# EAGLE design cdciom8 (EAGLE 6.6.0)
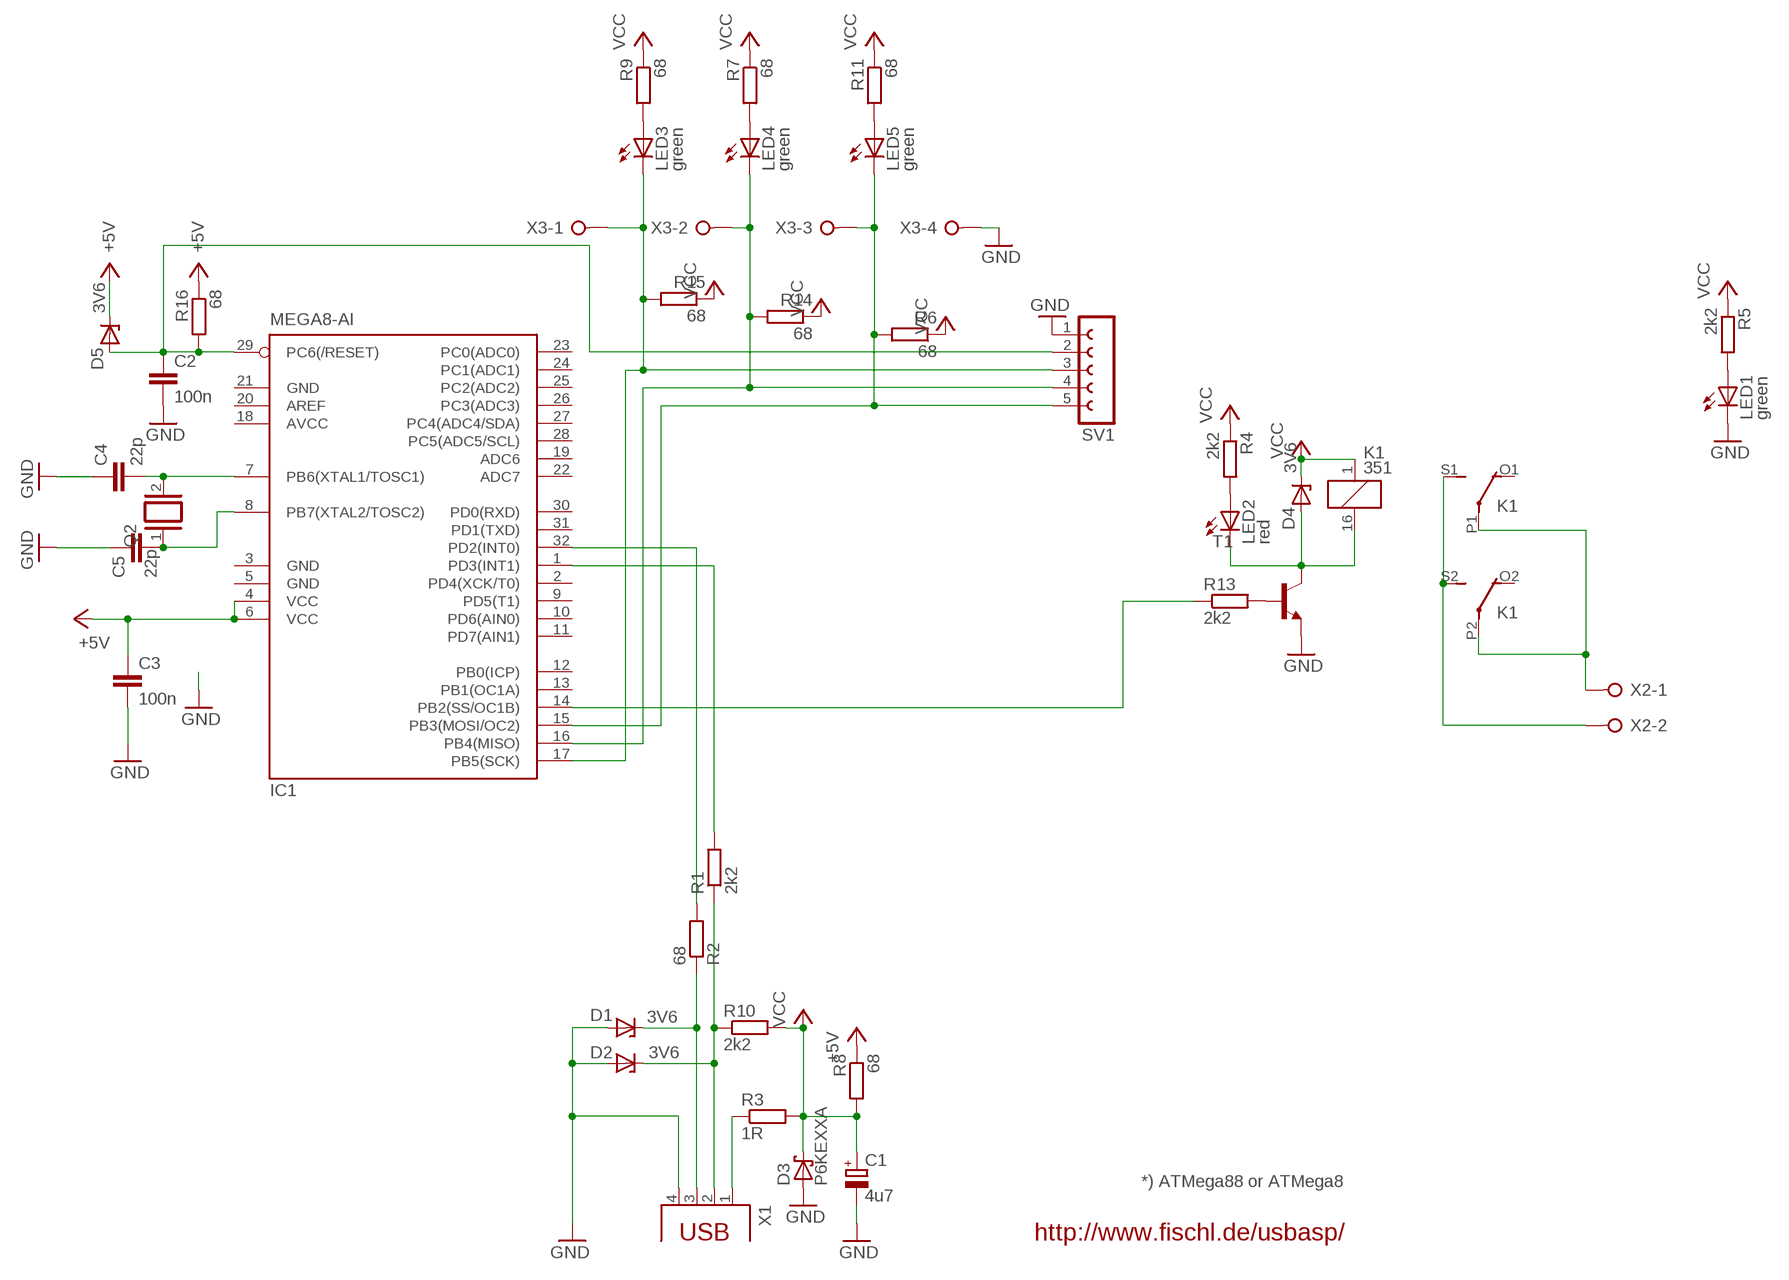
[diagram p0: schematic, sheet 1]

## Parts
C1  4u7  CPOL-EUE2.5-5  [E2,5-5]
C2  100n  C-EU025-024X044  [C025-024X044]
C3  100n  C-EU025-024X044  [C025-024X044]
C4  22p  C-EU025-024X044  [C025-024X044]
C5  22p  C-EU025-024X044  [C025-024X044]
D1  3V6  ZENER-DIODEDO34-7  [DO34Z7]
D2  3V6  ZENER-DIODEDO34-7  [DO34Z7]
D3  P6KEXXA  [C1702-15]
D4  3V6  ZENER-DIODEDO34-7  [DO34Z7]
D5  3V6  ZENER-DIODEDO34-7  [DO34Z7]
IC1  MEGA8-AI  [TQFP32-08]
K1  351  [351]
LED1  green  LED3MM  [LED3MM]
LED2  red  LED3MM  [LED3MM]
LED3  green  LED3MM  [LED3MM]
LED4  green  LED3MM  [LED3MM]
LED5  green  LED3MM  [LED3MM]
Q2  XTAL/S  [QS]
R1  2k2  R-EU_0207/2V  [0207/2V]
R2  68  R-EU_0207/10  [0207/10]
R3  1R  R-EU_0207/2V  [0207/2V]
R4  2k2  R-EU_0207/2V  [0207/2V]
R5  2k2  R-EU_0207/2V  [0207/2V]
R6  68  R-EU_0207/10  [0207/10]
R7  68  R-EU_0207/10  [0207/10]
R8  68  R-EU_0207/10  [0207/10]
R9  68  R-EU_0207/10  [0207/10]
R10  2k2  R-EU_0207/2V  [0207/2V]
R11  68  R-EU_0207/10  [0207/10]
R13  2k2  R-EU_0207/2V  [0207/2V]
R14  68  R-EU_0207/10  [0207/10]
R15  68  R-EU_0207/10  [0207/10]
R16  68  R-EU_0207/10  [0207/10]
SV1  FE05-1  [FE05-1]
T1  2N4124-NPN-TO92-CBE  [TO92-CBE]
X1  PN61729  [PN61729]
X2  W237-02P  [W237-132]
X3  W237-04P  [W237-4P]

## Nets
+5V: C3.1 D5.C IC1.4(VCC) IC1.6(VCC) R8.1 R16.1
GND: C1.- C2.2 C3.2 C4.1 C5.1 D1.A D2.A D3.A LED1.K(C) SV1.1 T1.E X1.4 X3.4
N$1: C2.1 D5.A IC1.29(PC6(/RESET)) R16.2 SV1.2
N$2: R13.2 T1.B
N$3: IC1.14(PB2(SS/OC1B)) R13.1
N$4: D4.A K1.16 LED2.K(C) T1.C
N$5: D2.C R1.1 R10.1 X1.2
N$6: K1.S1(2:S) K1.S2(3:S) X2.2
N$7: IC1.32(PD2(INT0)) R2.2
N$8: D1.C R2.1 X1.3
N$9: LED2.A R4.2
N$10: K1.P1(2:P) K1.P2(3:P) X2.1
N$11: R3.1 X1.1
N$12: LED1.A R5.2
N$13: LED3.A R9.2
N$14: LED4.A R7.2
N$15: LED5.A R11.2
N$16: IC1.1(PD3(INT1)) R1.2
N$17: IC1.17(PB5(SCK)) LED3.K(C) R15.2 SV1.3 X3.1
N$18: IC1.16(PB4(MISO)) LED4.K(C) R14.2 SV1.4 X3.2
N$19: IC1.15(PB3(MOSI/OC2)) LED5.K(C) R6.2 SV1.5 X3.3
N$22: C4.2 IC1.7(PB6(XTAL1/TOSC1)) Q2.2
N$23: C5.2 IC1.8(PB7(XTAL2/TOSC2)) Q2.1
VCC: C1.+ D3.C D4.C K1.1 R3.2 R4.1 R5.1 R6.1 R7.1 R8.2 R9.1 R10.2 R11.1 R14.1 R15.1
Unconnected: IC1.2(PD4(XCK/T0)) IC1.9(PD5(T1)) IC1.10(PD6(AIN0)) IC1.11(PD7(AIN1)) IC1.12(PB0(ICP)) IC1.13(PB1(OC1A)) IC1.19(ADC6) IC1.20(AREF) IC1.22(ADC7) IC1.23(PC0(ADC0)) IC1.24(PC1(ADC1)) IC1.25(PC2(ADC2)) IC1.26(PC3(ADC3)) IC1.27(PC4(ADC4/SDA)) IC1.28(PC5(ADC5/SCL)) IC1.30(PD0(RXD)) IC1.31(PD1(TXD)) K1.O1(2:O) K1.O2(3:O)

## Notes on the sheet
- *) ATMega88 or ATMega8
- http://www.fischl.de/usbasp/

## Power pins joined to a net without a drawn wire
AVCC: IC1.18(AVCC)
GND: IC1.3(GND) IC1.5(GND) IC1.21(GND)

## Library data of the parts
C1 = rcl:CPOL-EU: POLARIZED CAPACITOR, European symbol
C2-C5 = rcl:C-EU: CAPACITOR, European symbol
D1 D2 D4 D5 = diode:ZENER-DIODE: Z-Diode
D3 = diode:P6KEXXA: DIODE transient-voltage suppressor
IC1 = atmel:MEGA8: MICROCONTROLLER 8 Kbytes FLASH, 1 kbytes SRAM, 512 bytes EEPROM, USART, 6-channel 10 bit ADC, 2-channel 8 bit ADC Pin compatible with Atmega48, ATMega88, ATMega168 Source: avr.lbr; MPN: ATMEGA8-16AU; OC_FARNELL: 9171371; OC_NEWARK: 73M8863
K1 = relay:351: RELAY 2 x switch, Omron; OC_FARNELL: unknown; OC_NEWARK: unknown
LED1-LED5 = led:LED: LED OSRAM: - CHIPLED LG R971, LG N971, LY N971, LG Q971, LY Q971, LO R971, LY R971 LH N974, LH R974 LS Q976, LO Q976, LY Q976 LO Q996 - Hyper CHIPLED LW Q18S LB Q993, LB Q99A, LB R99A - SideLED LS A670, LO A670, LY A670, LG A670, LP A670 LB A673, LV A673, LT A673, LW A673 LH A674 LY A675 LS A676, LA A676, LO A676, LY A676, LW A676 LS A679, LY A679, LG A679 - Hyper Micro SIDELED® LS Y876, LA Y876, LO Y876, LY Y876 LT Y87S - SmartLED LW L88C, LW L88S LB L89C, LB L89S, LG L890 LS L89K, LO L89K, LY L89K LS L896, LA L896, LO L896, LY L896 - TOPLED LS T670, LO T670, LY T670, LG T670, LP T670 LSG T670, LSP T670, LSY T670, LOP T670, LYG T670 LG T671, LOG T671, LSG T671 LB T673, LV T673, LT T673, LW T673 LH T674 LS T676, LA T676, LO T676, LY T676, LB T676, LH T676, LSB T676, LW T676 LB T67C, LV T67C, LT T67C, LS T67K, LO T67K, LY T67K, LW E67C LS E67B, LA E67B, LO E67B, LY E67B, LB E67C, LV E67C, LT E67C LW T67C LS T679, LY T679, LG T679 LS T770, LO T770, LY T770, LG T770, LP T770 LB T773, LV T773, LT T773, LW T773 LH T774 LS E675, LA E675, LY E675, LS T675 LS T776, LA T776, LO T776, LY T776, LB T776 LHGB T686 LT T68C, LB T68C - Hyper Mini TOPLED® LB M676 - Mini TOPLED Santana® LG M470 LS M47K, LO M47K, LY M47K Source: http://www.osram.convergy.de/
Q2 = special:XTAL/S: CRYSTAL
R1-R11 R13-R16 = rcl:R-EU_: RESISTOR, European symbol
SV1 = con-lsta:FE05-1: FEMALE HEADER; OC_FARNELL: unknown; OC_NEWARK: unknown
T1 = transistor:*-NPN-: NPN Transistror BF959 corrected 2008.03.06
X1 = con-berg:PN61729: BERG USB connector
X2 = con-wago-508:W237-02P: WAGO SREW CLAMP; OC_FARNELL: unknown; OC_NEWARK: unknown
X3 = con-wago-508:W237-04P: WAGO SREW CLAMP; OC_FARNELL: unknown; OC_NEWARK: unknown

## Board
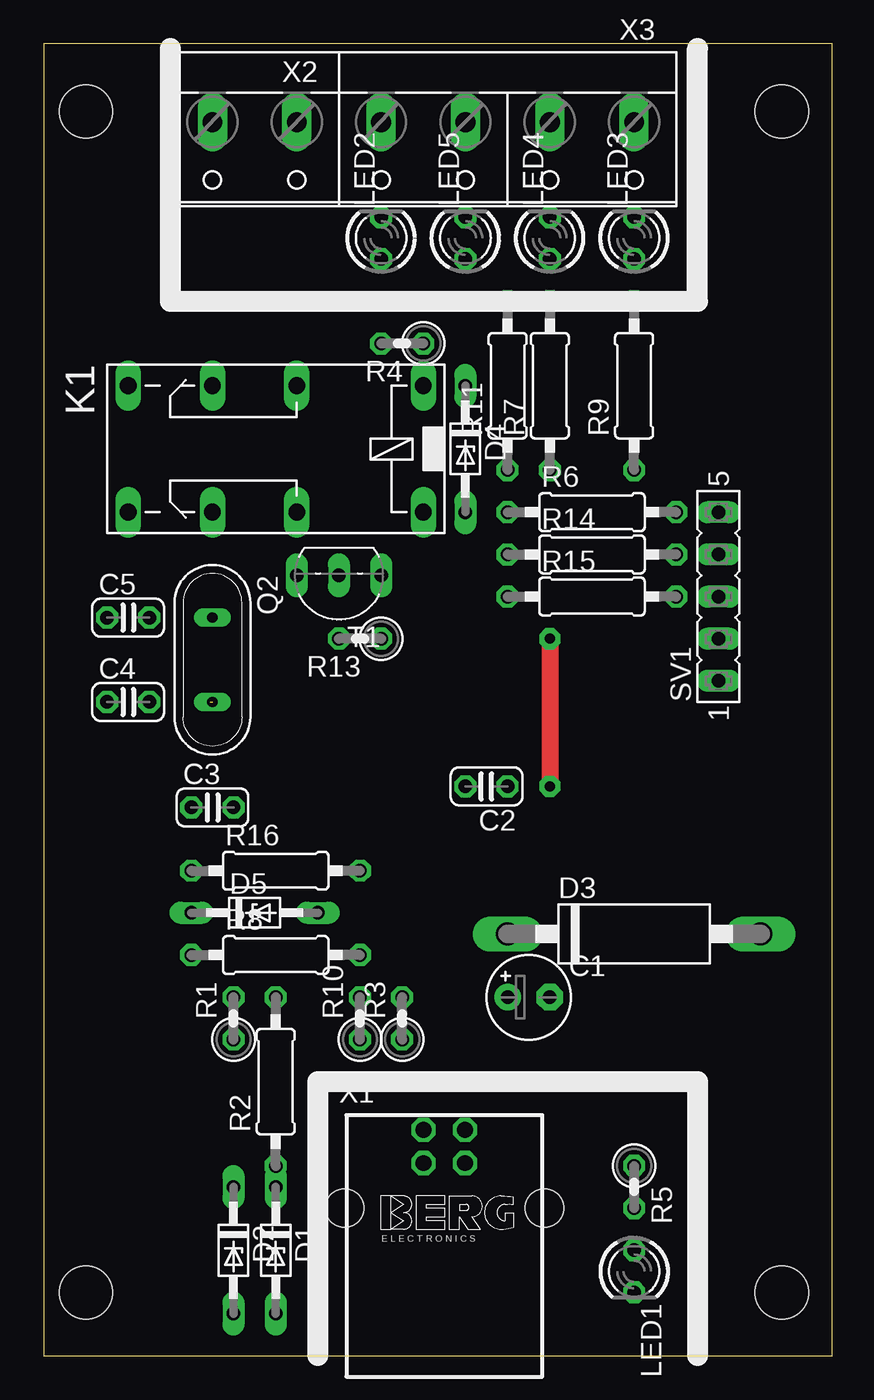
[diagram p1: board, top side]
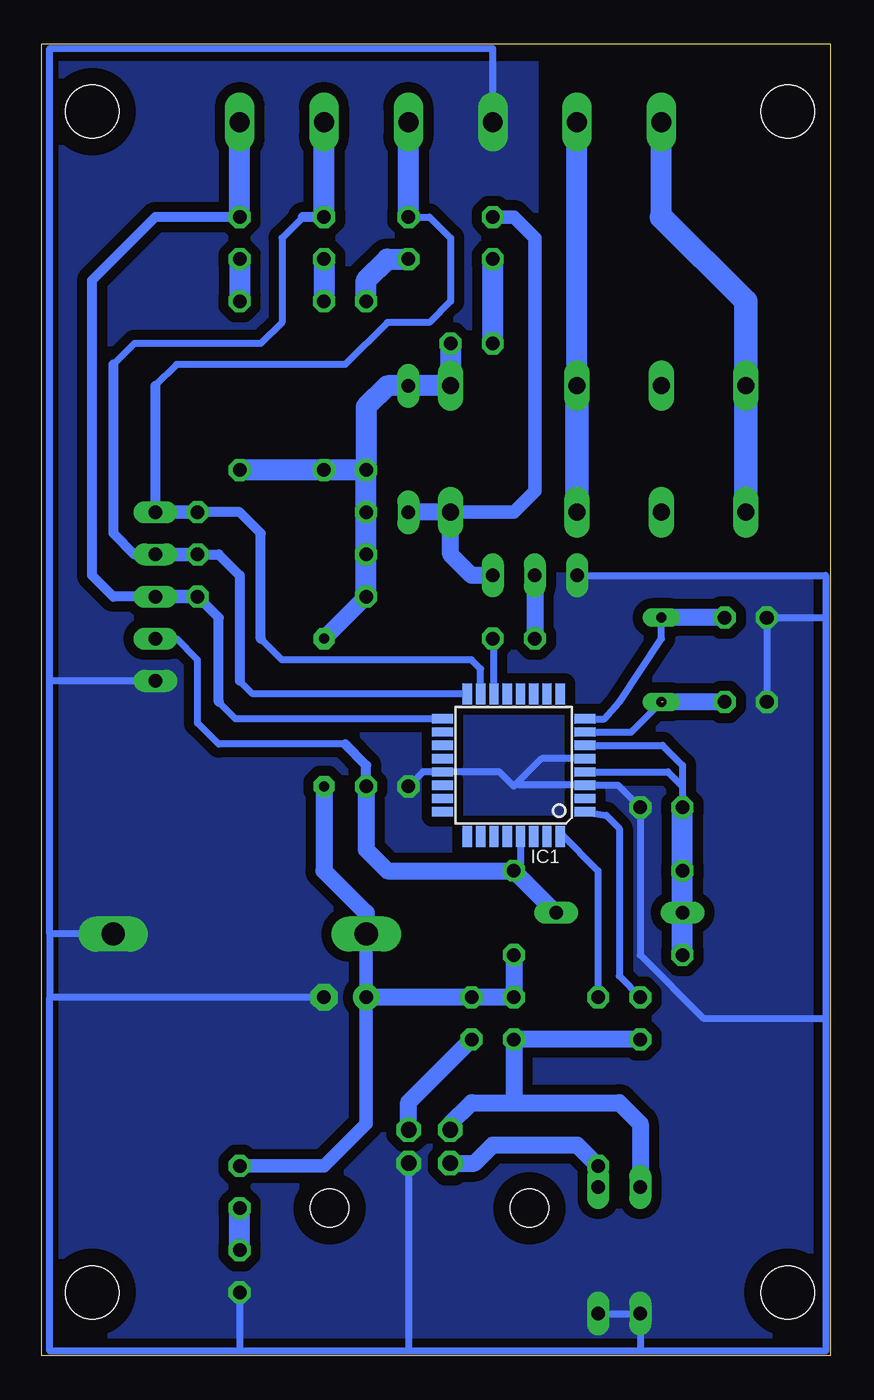
[diagram p2: board, bottom side, seen from below]

Size 47.5 x 79 mm. Coordinates in mm from the lower left corner, seen from the top.
Outline: 0,0 47.5,0 47.5,79 0,79 0,0
Copper layers (1*16): Top 0.035mm / dielectric 1.5mm / Bottom 0.035mm
Design rules "default": minimum track width 10mil, minimum drill 24mil, track to track 8mil, track to pad 8mil, pad to pad 8mil, via to via 8mil, smd to smd 8mil, copper to edge 40mil, drill to drill 8mil, minimum pad ring 10mil, minimum via ring 8mil, stop-mask expansion 4mil, vias tented up to drill 0mil, thermal gap 10mil
Holes 3.2 mm at 44.45,3.81 2.54,3.81 2.54,74.93 44.45,74.93

### Footprints (pad centres in the part's own frame; a part is rotated, then mirrored left to right if it is on the bottom)
E2,5-5 = drill 0.813 pad 1.6: + -1.27,0 | drill 0.813 pad 1.6 octagon: - 1.27,0
C025-024X044 = drill 0.813 octagon: 1 -1.27,0; 2 1.27,0
DO34Z7 = drill 0.813 long: A 3.81,0; C -3.81,0
C1702-15 = drill 1.397 long: A 7.62,0; C -7.62,0
TQFP32-08 = smd 1.27 x 0.559: 1 -4.293,2.8; 2 -4.293,2; 3 -4.293,1.2; 4 -4.293,0.4; 5 -4.293,-0.4; 6 -4.293,-1.2; 7 -4.293,-2; 8 -4.293,-2.8; 17 4.293,-2.8; 18 4.293,-2; 19 4.293,-1.2; 20 4.293,-0.4; 21 4.293,0.4; 22 4.293,1.2; 23 4.293,2; 24 4.293,2.8 | smd 0.559 x 1.27: 9 -2.8,-4.293; 10 -2,-4.293; 11 -1.2,-4.293; 12 -0.4,-4.293; 13 0.4,-4.293; 14 1.2,-4.293; 15 2,-4.293; 16 2.8,-4.293; 25 2.8,4.293; 26 2,4.293; 27 1.2,4.293; 28 0.4,4.293; 29 -0.4,4.293; 30 -1.2,4.293; 31 -2,4.293; 32 -2.8,4.293
351 = drill 1.016 long: 1 -3.81,-3.81; 16 -3.81,3.81; O1 8.89,-3.81; O2 8.89,3.81; P1 3.81,-3.81; P2 3.81,3.81; S1 13.97,-3.81; S2 13.97,3.81
LED3MM = drill 0.813 octagon: A -1.27,0; K 1.27,0
QS = drill 0.61 long: 1 -2.54,0; 2 2.54,0
0207/2V = drill 0.813 octagon: 1 -1.27,0; 2 1.27,0
0207/10 = drill 0.813 octagon: 1 -5.08,0; 2 5.08,0
FE05-1 = drill 0.813 long: 1 -5.08,0; 2 -2.54,0; 3 0,0; 4 2.54,0; 5 5.08,0
TO92-CBE = drill 0.813 long: B 0,0; C -2.54,0; E 2.54,0
PN61729 = drill 0.95 octagon: 1 1.25,4.71; 2 -1.25,4.71; 3 -1.25,2.71; 4 1.25,2.71 | hole 2.3: -6.02,0; 6.02,0
W237-132 = drill 1.194 long: 1 -2.54,-0.635; 2 2.54,-0.635
W237-4P = drill 1.194 long: 1 -7.62,-0.635; 2 -2.54,-0.635; 3 2.54,-0.635; 4 7.62,-0.635

### Placement (x,y rotation side)
C1  29.21,21.59 0 top
C2  26.67,34.29 180 top
C3  10.16,33.02 0 top
C4  5.08,39.37 0 top
C5  5.08,44.45 0 top
D1  13.97,6.35 270 top
D2  11.43,6.35 270 top
D3  35.56,25.4 0 top
D4  25.4,54.61 270 top
D5  12.7,26.67 0 top
IC1  19.05,35.56 180 bottom
K1  19.05,54.61 180 top
LED1  35.56,5.08 270 top
LED2  20.32,67.31 90 top
LED3  35.56,67.31 90 top
LED4  30.48,67.31 90 top
LED5  25.4,67.31 90 top
Q2  10.16,41.91 270 top
R1  11.43,20.32 90 top
R2  13.97,16.51 90 top
R3  21.59,20.32 90 top
R4  21.59,60.96 180 top
R5  35.56,10.16 270 top
R6  33.02,50.8 0 top
R7  30.48,58.42 90 top
R8  13.97,24.13 0 top
R9  35.56,58.42 90 top
R10  19.05,20.32 90 top
R11  27.94,58.42 90 top
R13  19.05,43.18 180 top
R14  33.02,48.26 0 top
R15  33.02,45.72 0 top
R16  13.97,29.21 0 top
SV1  40.64,45.72 90 top
T1  17.78,46.99 180 top
X1  24.13,8.89 0 top
X2  12.7,73.66 180 top
X3  27.94,73.66 180 top

### Tracks (layer width: path | path; a pad name or v marks a point on that pad's centre or on a via)
+5V
  Bottom 0.406: IC1.6 10.09,36.76 8.89,35.56 8.89,34.29 | 8.89,34.29 C3.1 | IC1.4 9.76,35.16 8.89,34.29
  Bottom 1.27: R8.1 D5.C R16.1 C3.1
GND
  Bottom 0.406: 46.99,21.59 46.99,0.27 35.56,0.27 | 46.99,25.4 46.99,40.64 | 46.99,40.64 46.99,78.74 20.32,78.74 X3.4 | 0.27,44.45 0.27,46.99 T1.E | 0.27,44.45 0.27,20.32 | 0.27,20.32 0.27,0.27 11.43,0.27 | 11.43,0.27 25.4,0.27 | 25.4,0.27 35.56,0.27 | C4.1 C5.1 0.27,44.45 | D1.A D2.A 11.43,0.27 | X1.4 25.38,4.1 25.4,0.27 | LED1.K 35.56,0.27 | C1.- 46.99,21.59 | D3.A 46.99,25.4 | 46.99,25.4 46.99,21.59 | SV1.1 46.99,40.64 | 18.98,34.36 IC1.3 12.77,34.36 C3.2 11.43,24.13 7.62,20.32 0.27,20.32 | 18.98,34.36 19.05,34.29 19.92,35.16 IC1.21 24.53,35.16 C2.2 | IC1.5 17.38,35.96 18.98,34.36
  pour Bottom (isolate 0.61, no thermals): -1.27,46.99 -1.27,-1.27 48.26,-1.27 48.26,80.01 17.78,80.01 17.78,46.99
N$1
  Bottom 0.406: IC1.29 18.65,29.61 R16.2 | 29.21,36.83 36.83,36.83 38.1,38.1 38.1,41.91 39.37,43.18 SV1.2
  Bottom 0.61: C2.1 27.94,35.56 29.21,36.83
  Bottom 1.016: D5.A R16.2 26.67,29.21 27.94,30.48 C2.1
N$2
  Bottom 1.016: T1.B R13.2
N$3
  Bottom 0.406: IC1.14 20.25,43.25 R13.1
N$4
  Bottom 0.813: LED2.K 19.05,68.58 17.78,67.31 17.78,52.07 19.05,50.8 K1.16
  Bottom 1.016: T1.C 21.59,46.99 22.86,48.26 K1.16 D4.A
N$5
  Bottom 1.016: X1.2 22.88,13.95 21.59,15.24 19.05,15.24 | 19.05,15.24 12.7,15.24 11.43,13.97 D2.C | R1.1 R10.1 19.05,15.24
N$6
  Bottom 1.27: 10.16,68.58 X2.2
  Bottom 1.422: K1.S2 K1.S1 5.08,63.5 10.16,68.58
N$7
  Bottom 0.406: R2.2 13.97,29.21 16.25,31.49 IC1.32
N$8
  Bottom 1.016: X1.3 21.42,11.6 20.32,12.7 15.24,12.7 R2.1
  Bottom 1.27: R2.1 D1.C
N$9
  Bottom 1.27: R4.2 LED2.A
N$10
  Bottom 1.27: K1.P1 X2.1 15.24,74.93
  Bottom 1.422: K1.P1 K1.P2
N$11
  Bottom 1.016: X1.1 25.38,15.26 R3.1
N$12
  Bottom 1.27: LED1.A R5.2
N$13
  Bottom 1.27: LED3.A R9.2
N$14
  Bottom 1.27: LED4.A R7.2
N$15
  Bottom 1.27: R11.2 27.94,64.77 26.67,66.04 LED5.A
N$16
  Bottom 0.406: IC1.1 13.49,32.54 12.7,31.75 12.7,22.86 R1.2
N$17
  Bottom 0.406: IC1.17 35.82,38.36 36.83,39.37
  Bottom 0.61: LED3.K 40.64,68.58 44.45,64.77 44.45,46.99 43.18,45.72 SV1.3 | 36.83,39.37 36.83,44.45 R15.2
  Bottom 0.813: R15.2 SV1.3
  Bottom 1.27: LED3.K X3.1
N$18
  Bottom 0.406: 31.75,68.58 33.02,67.31 33.02,62.23 34.29,60.96 41.91,60.96 43.18,59.69 | IC1.16 34.77,39.85 35.56,40.64
  Bottom 0.61: LED4.K 31.75,68.58 | 43.18,59.69 43.18,49.53 41.91,48.26 SV1.4 | R14.2 36.83,48.26 35.56,46.99 35.56,40.64
  Bottom 0.813: SV1.4 R14.2
  Bottom 1.27: LED4.K X3.2
N$19
  Bottom 0.406: LED5.K 24.13,68.58 22.86,67.31 22.86,63.5 24.13,62.23 26.67,62.23 29.21,59.69 39.37,59.69 40.64,58.42 | IC1.15 21.05,41.37 21.59,41.91 33.02,41.91 34.29,43.18
  Bottom 0.61: 40.64,58.42 SV1.5 | 34.29,43.18 34.29,49.53 35.56,50.8 R6.2
  Bottom 0.813: R6.2 SV1.5
  Bottom 1.27: LED5.K X3.3
N$22  (1 unrouted)
  Bottom 0.406: IC1.7 11.97,37.56 Q2.2
  Bottom 1.016: C4.2 10.03,39.37
N$23
  Bottom 0.406: IC1.8 13.58,38.36 12.7,39.37 10.16,43.18 Q2.1 10.03,44.45
  Bottom 1.016: C5.2 10.03,44.45
VCC  (via drill 0.6 pad 1.27)
  Top 1.016: v30.48,43.18 v30.48,34.29
  Bottom 0.813: D3.C C1.+ 27.94,13.97 30.48,11.43 R5.1
  Bottom 1.016: C1.+ R3.2 R10.2 R8.2 | R15.1 v30.48,43.18 | v30.48,34.29 30.48,29.21 27.94,26.67 D3.C
  Bottom 1.27: R15.1 R14.1 R6.1 R11.1 | R4.1 K1.1 D4.C 26.67,58.42 27.94,57.15 R11.1 | R11.1 R7.1 R9.1